# EAGLE design GBP USB-C Charging Kit (EAGLE 6.2)
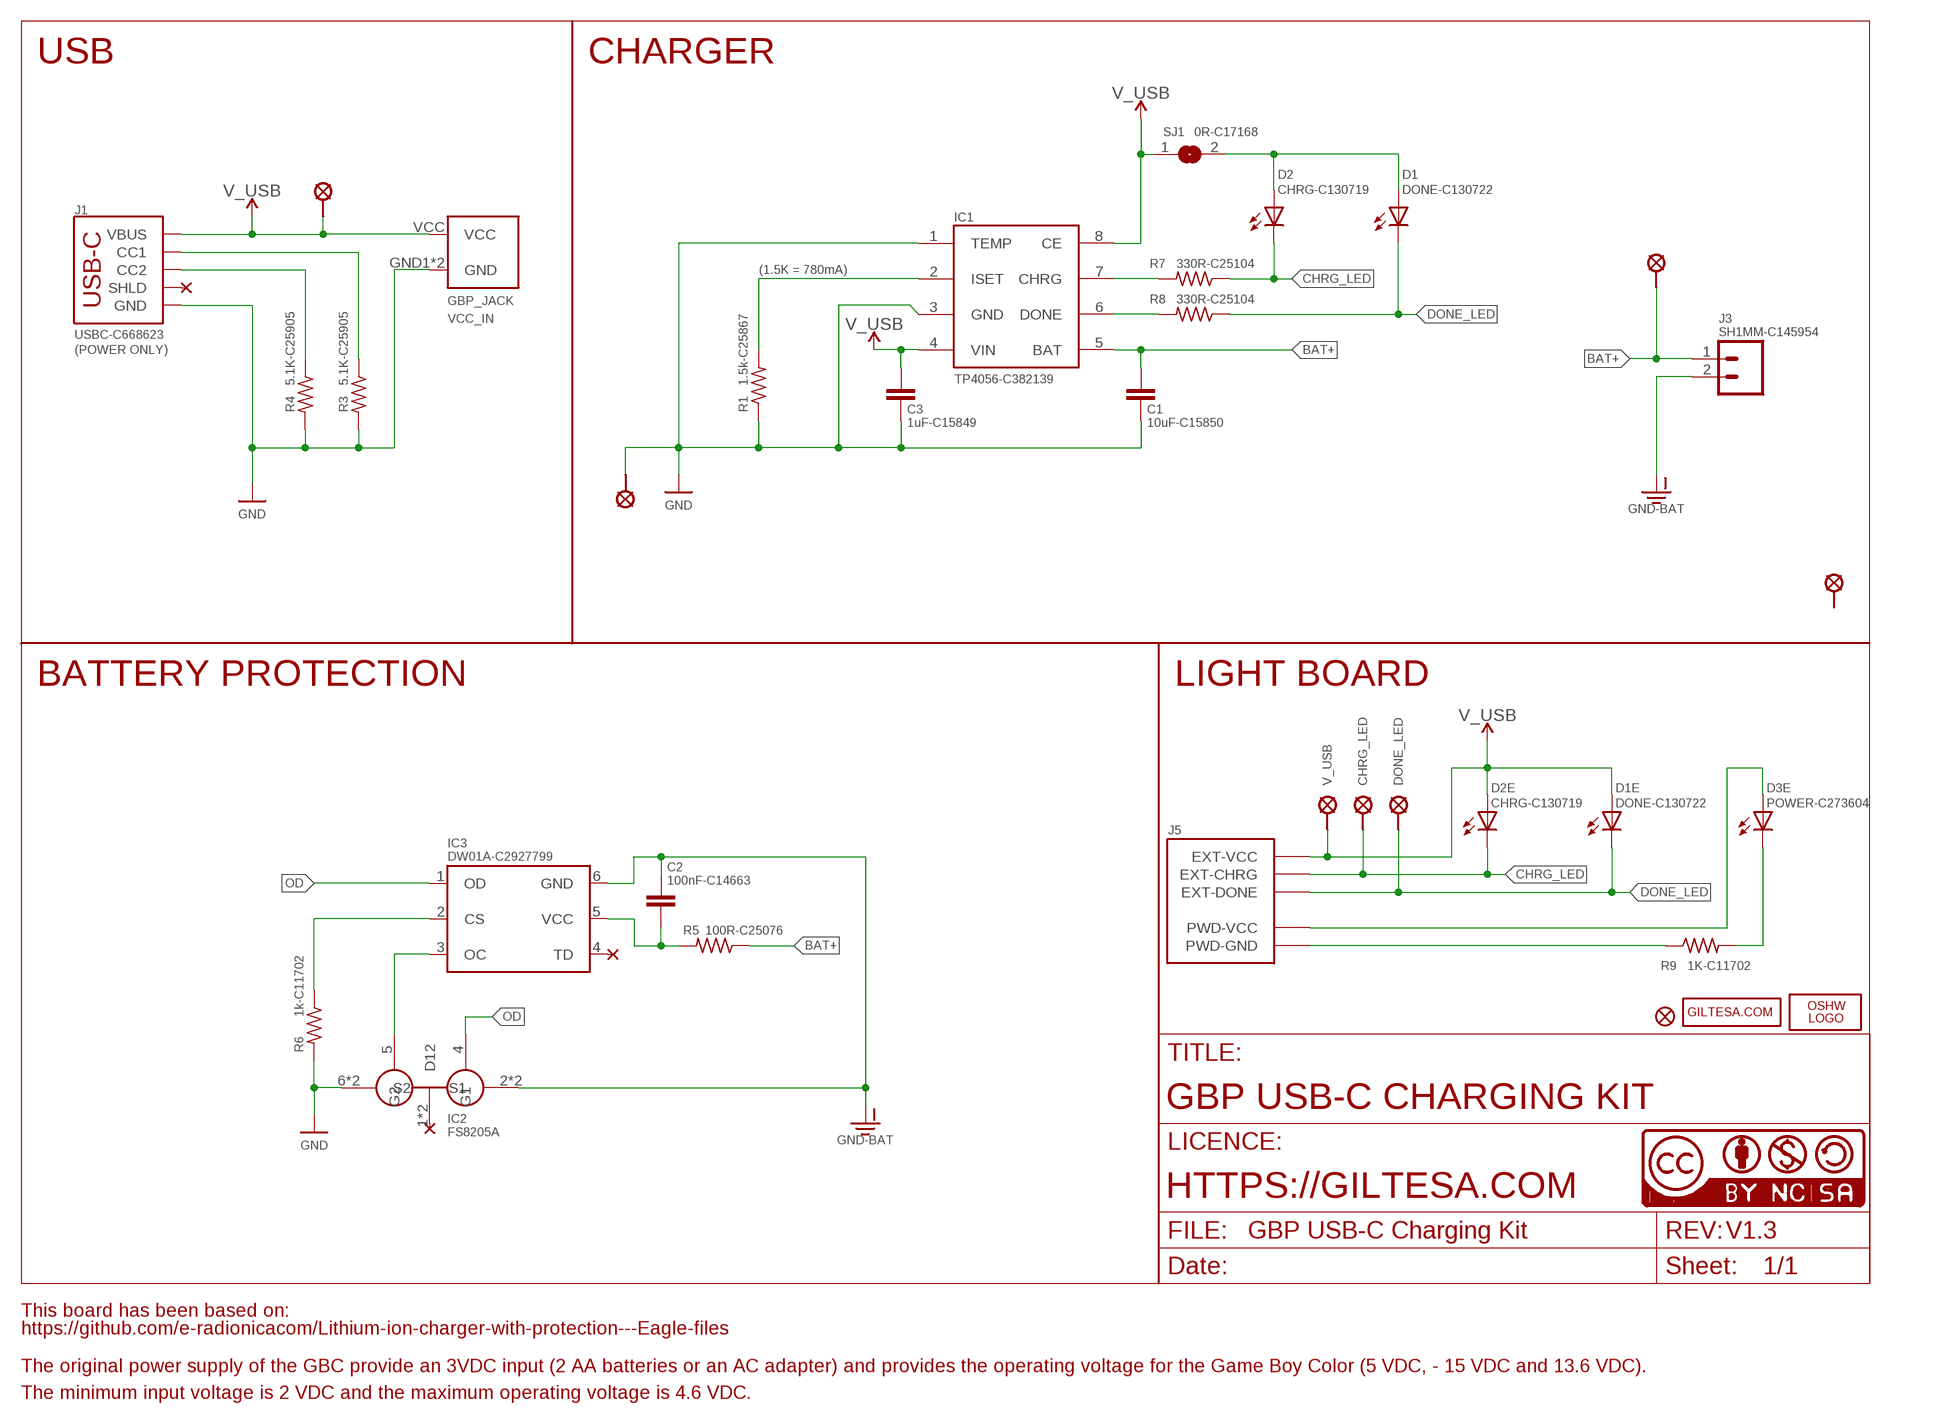
[diagram p0: schematic, sheet 1]

## Parts
C1  10uF-C15850  C0805_SMALL  [C0805_S]
C2  100nF-C14663  C0603_SMALL  [C0603_S]
C3  1uF-C15849  C0603_SMALL  [C0603_S]
D1  DONE-C130722  L0402  [L0402]
D1E  DONE-C130722  L0402  [L0402]
D2  CHRG-C130719  L0402  [L0402]
D2E  CHRG-C130719  L0402  [L0402]
D3E  POWER-C273604  L0402  [L0402]
FD1  FIDUCIALUFIDUCIAL  [FIDUCIAL-MICRO]
FD2  FIDUCIALUFIDUCIAL  [FIDUCIAL-MICRO]
FD3  FIDUCIALUFIDUCIAL  [FIDUCIAL-MICRO]
GBP_JACK  VCC_IN  GBP_POWER_JACK_DIP  [GBP_POWER_JACK_DIP]
IC1  TP4056-C382139  DIO5158  [SOIC-8]
IC2  8205A-C2929075  FS8205A  [TSSOP8]
IC3  DW01A-C2927799  DW01-P  [SOT23-6L]
J1  USBC-C668623  USB-CPOWER  [USB-C_6P]
J3  SH1MM-C145954  JST-21MM  [JST-2-1MM-SMD_RIGHT]
J5  GBP_LED  [GBP_LED]
LOGO2  OSHW_LOGO_FILLX0150-NT  [OSHW_FILLX150_NOTEXT]
R1  1.5k-C25867  R0402  [R0402]
R3  5.1K-C25905  R0402  [R0402]
R4  5.1K-C25905  R0402  [R0402]
R5  100R-C25076  R0402  [R0402]
R6  1k-C11702  R0402  [R0402]
R7  330R-C25104  R0402  [R0402]
R8  330R-C25104  R0402  [R0402]
R9  1K-C11702  R0402  [R0402]
SJ1  0R-C17168  JUMPER-SMD0402  [JUMPER-SMD_0402]
U$2  PAD_2.0  [PAD_2.0]
U$3  PAD_1.25  [PAD_1.25]
U$6  CC-BY-NC-SA15MM  [CC-BY-NC-SA_15MM]
U$12  SOLDER_PAD-2.0  [SOLDER_PAD_2.0]
U$16  GILTESA.COM_MASK  [GILTESA.COM_MASK]
U$24  CHRG_LED  SOLDER_PAD-1.3  [SOLDER_PAD_1.3]
U$25  DONE_LED  SOLDER_PAD-1.3  [SOLDER_PAD_1.3]
U$26  V_USB  SOLDER_PAD-1.3  [SOLDER_PAD_1.3]
U$41  PAD_1.25  [PAD_1.25]

## Nets
BAT+: C1.1 IC1.5(BAT) J3.1 R5.1 U$3.P$1
CHRG: IC1.7(CHRG) R7.2
CHRG_LED: D2.C D2E.C J5.EXT-CHRG R7.1 U$24.P$1
DONE: IC1.6(DONE) R8.2
DONE_LED: D1.C D1E.C J5.EXT-DONE R8.1 U$25.P$1
GND: C1.2 C3.2 GBP_JACK.GND1(GND) GBP_JACK.GND2(GND) IC1.1(TEMP) IC1.3(GND) IC2.6(S2) IC2.7(S2) J1.GND1(GND) J1.GND2(GND) R1.1 R3.2 R4.2 R6.2 U$2.P$1
GND-BAT: C2.1 IC2.2(S1) IC2.3(S1) IC3.6(GND) J3.2
ISET: IC1.2(ISET) R1.2
N$1: IC3.2(CS) R6.1
N$2: IC2.5(G2) IC3.3(OC)
N$4: J1.B5(CC2) R4.1
N$5: D1.A D2.A SJ1.2
N$11: D3E.C R9.2
N$13: J1.A5(CC1) R3.1
OD: IC2.4(G1) IC3.1(OD)
PWD-GND: J5.PWD-GND J5.PWD-GND'(PWD-GND) R9.1
PWD-VCC: D3E.A J5.PWD-VCC J5.PWD-VCC'(PWD-VCC)
V_USB: C3.1 D1E.A D2E.A GBP_JACK.VCC IC1.4(VIN) IC1.8(CE) J1.VBUS1(VBUS) J1.VBUS2(VBUS) J5.EXT-VCC SJ1.1 U$26.P$1 U$41.P$1
VCC-DW: C2.2 IC3.5(VCC) R5.2
Unconnected: IC2.1(D12) IC2.8(D12) IC3.4(TD) J1.SHLD1(SHLD) J1.SHLD2(SHLD) J1.SHLD3(SHLD) J1.SHLD4(SHLD) J1.SHLD5(SHLD) J1.SHLD6(SHLD) J1.SHLD7(SHLD) J1.SHLD8(SHLD) U$12.P$1

## Notes on the sheet
- USB | CHARGER
- (1.5K = 780mA)
- (POWER ONLY)
- BATTERY PROTECTION | LIGHT BOARD
- GBP USB-C CHARGING KIT
- IC2
- FS8205A
- HTTPS://GILTESA.COM
- V1.3
- This board has been based on:
- https://github.com/e-radionicacom/Lithium-ion-charger-with-protection---Eagle-files
- The original power supply of the GBC provide an 3VDC input (2 AA batteries or an AC adapter) and provides the operating voltage for the Game Boy Color (5 VDC, - 15 VDC and 13.6 VDC).
- The minimum input voltage is 2 VDC and the maximum operating voltage is 4.6 VDC.

## Library data of the parts
C1 = ,giltesa:C0805
C2 C3 = ,giltesa:C0603
D1 D1E D2 D2E D3E = ,giltesa:L0402
FD1-FD3 = SparkFun-Aesthetics:FIDUCIAL: Fiducial Alignment Points Point-of-reference for pick-and-place machines and other optical instruments.
GBP_JACK = ,giltesa:GBP_POWER_JACK
IC1 = ERADIONICA:DIO5158
IC2 = SparkFun:FS8205A
IC3 = lipo:DW01-P: One Cell Lithium-ion/Polymer Battery Protection IC The DW01-P battery protection IC is designed to protect lithium-ion/polymer battery from damage or degrading the lifetime due to overcharge, overdischarge, and/or overcurrent for one-cell lithium-ion/polymer battery powered systems, such as cellular phones. The ultra-small package and less required external components make it ideal to integrate the DW01-P into the limited space of battery pack. The accurate ±50mV overcharging detection voltage ensures safe and full utilization charging. The very low standby current drains little current from the cell while in storage.
J1 = ,giltesa:USB-C
J3 = ,giltesa:JST-2
J5 = ,giltesa:GBP_LED
LOGO2 = ohw-logo:OSHW_LOGO_FILL
R1 R3-R9 = ,giltesa:R0402
SJ1 = ,giltesa:JUMPER-SMD
U$2 U$3 U$41 = ,giltesa:PAD
U$6 = ,giltesa_logos:CC-BY-NC-SA
U$12 U$24-U$26 = ,giltesa:SOLDER_PAD
U$16 = ,giltesa_logos:GILTESA.COM

## Net classes
1 power: width 0.61 mm, drill 0.406 mm, clearance 0.203 mm
2 gnd: width 0.305 mm, drill 0.406 mm, clearance 0.203 mm
3 power usb: width 0.508 mm, drill 0.406 mm, clearance 0.203 mm

## Board
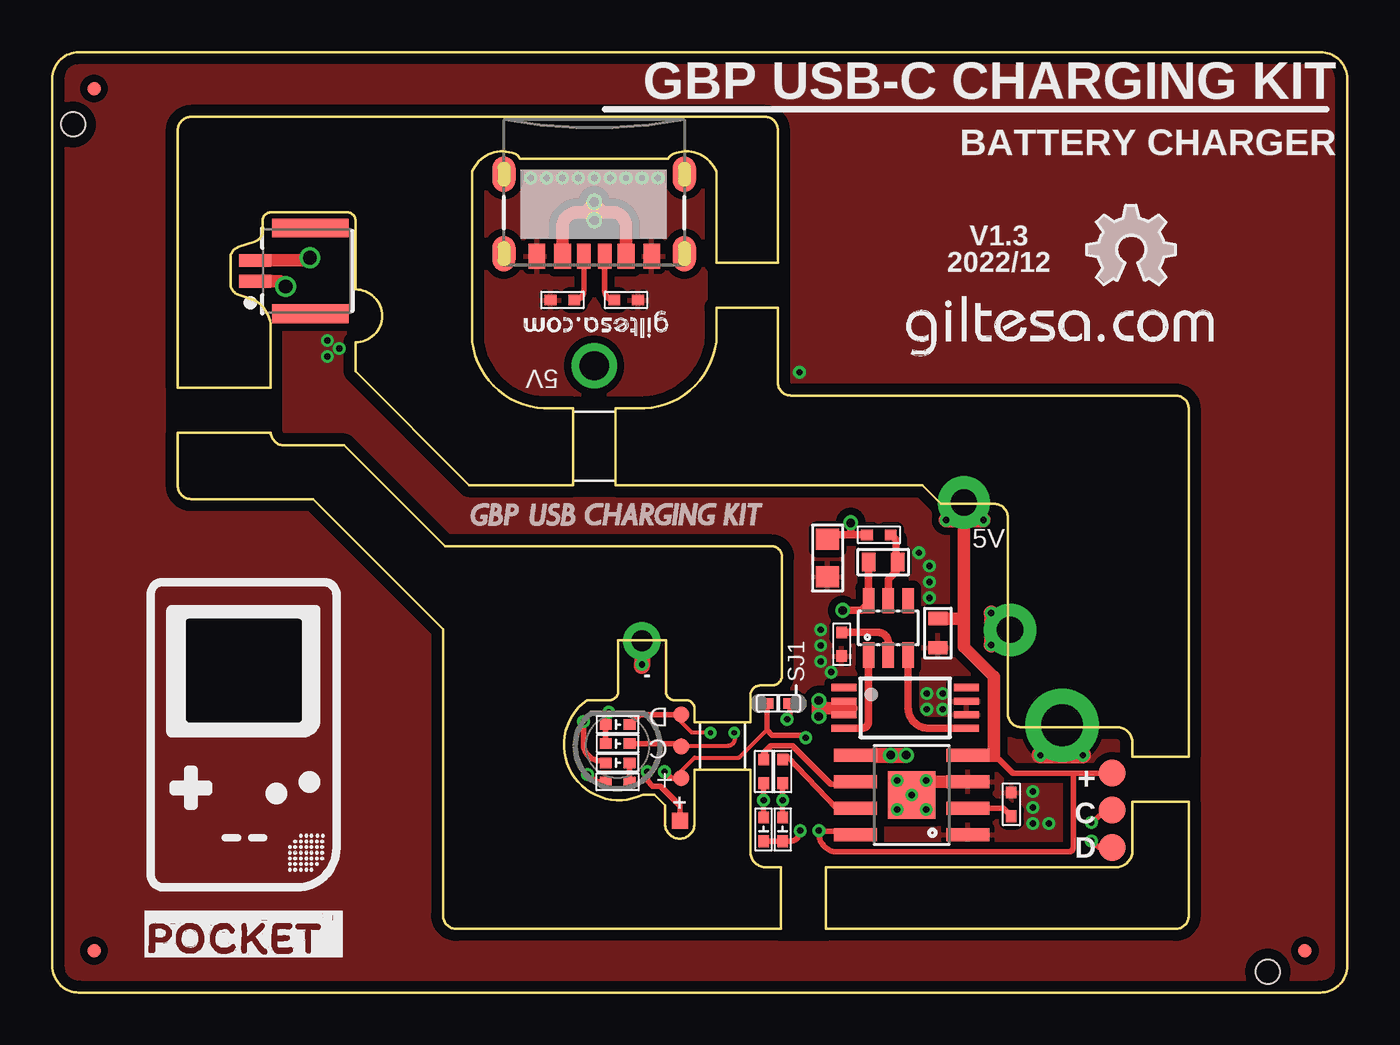
[diagram p1: board, top side]
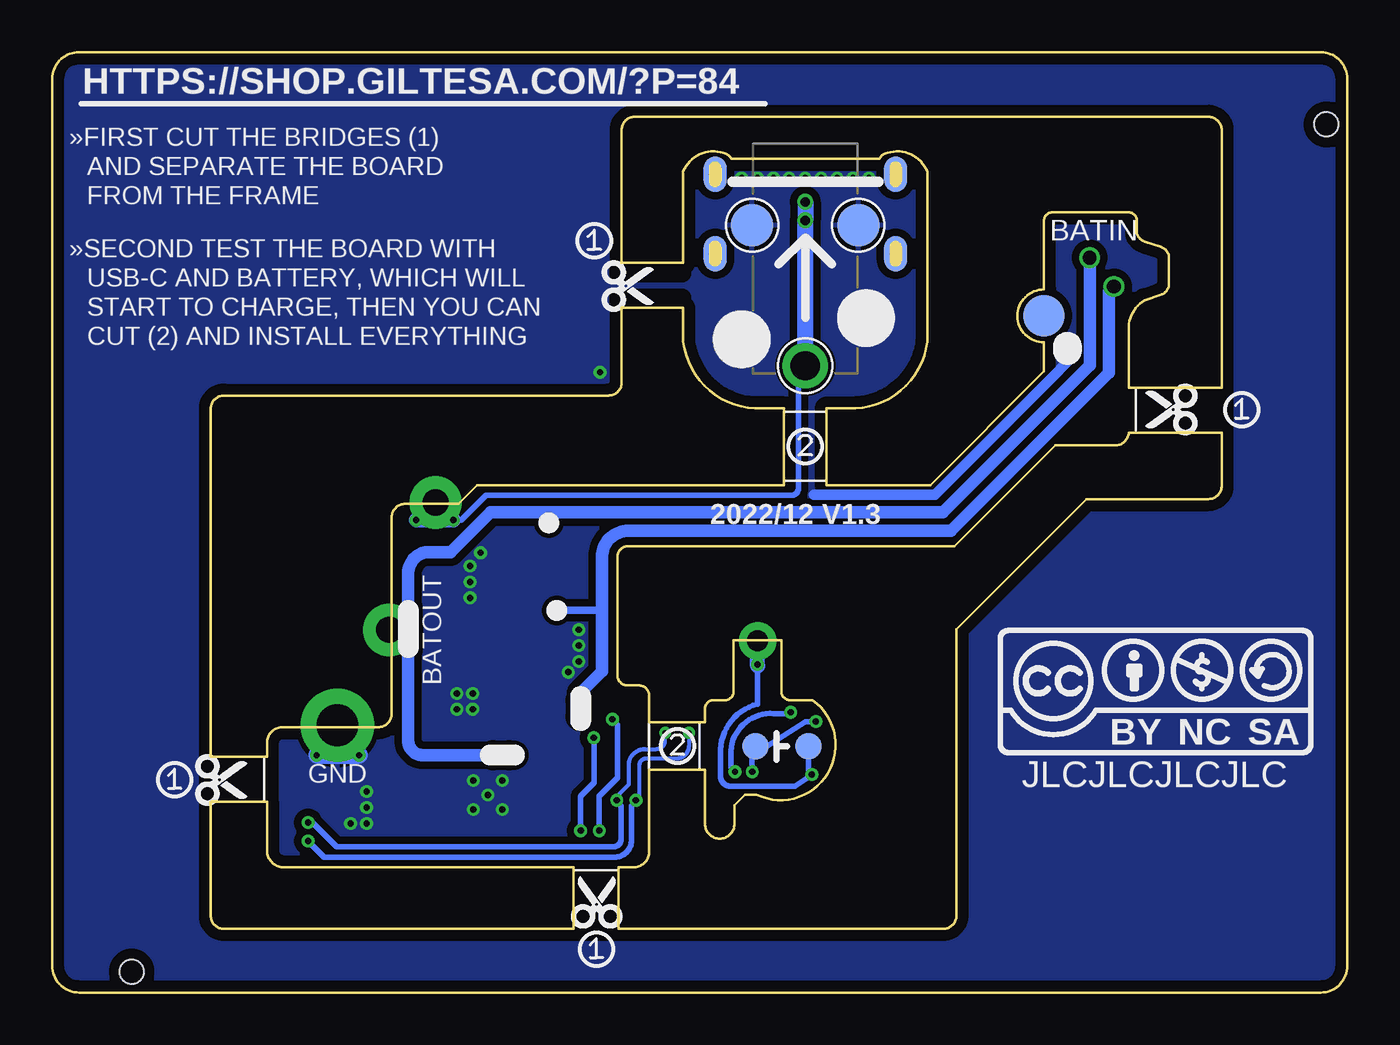
[diagram p2: board, bottom side, seen from below]

Size 62 x 45 mm. Coordinates in mm from the lower left corner, seen from the top.
Outline: 13.99,26.18 11.19,26.18 arc-90 10.46,26.79 6.01,26.79 6.01,24.25 arc90 6.64,23.62 12.49,23.62 18.71,17.39 18.71,3.68 arc90 19.35,3.04 34.89,3.04 34.89,5.99 34.18,5.99 arc-90 33.42,6.75 33.42,10.66 30.75,10.66 30.75,8.07 arc-180 29.34,8.07 29.34,8.96 28.83,9.46 28.27,9.46 arc-170 25.6,13.99 26.71,13.99 arc90 27.09,14.44 27.09,16.86 29.38,16.86 29.38,14.44 arc90 29.76,13.99 30.37,13.99 arc-90 30.75,13.55 30.75,12.94 33.42,12.94 33.42,14.19 arc-90 33.92,14.7 34.43,14.7 arc90 34.94,15.16 34.94,20.85 arc90 34.43,21.36 18.81,21.36 13.99,26.18
Outline: 19.95,24.28 14.52,29.74 14.52,31.11 arc180 14.52,33.65 14.52,36.95 arc90 14.14,37.33 10.46,37.33 arc90 10.07,36.95 10.07,36.32 arc-50 9.69,35.94 8.93,35.68 arc60 8.55,35.3 8.55,33.78 arc60 8.93,33.4 9.69,33.14 arc-50 10.46,32 10.46,28.95 6.01,28.95 6.01,41.27 arc-90 6.64,41.91 34.13,41.91 arc-90 34.74,41.27 34.74,34.92 31.79,34.92 31.79,39.3 arc90 29.74,40.14 arc40 29.49,39.9 22.4,39.9 arc40 22.16,40.14 arc90 20.11,39.3 20.11,31.14 arc80 23.54,27.96 24.93,27.96 24.93,24.28 19.95,24.28
Outline: 51.72,9.12 51.72,6.88 arc-90 50.96,5.99 37.05,5.99 37.05,3.04 53.78,3.04 arc90 54.41,3.68 54.41,9.12 51.72,9.12
Outline: 26.96,24.28 41.66,24.28 42.55,23.38 45.09,23.38 arc-90 45.75,22.75 45.75,13.34 arc90 46.38,12.7 50.96,12.7 arc-90 51.72,11.94 51.72,11.28 54.41,11.28 54.41,27.94 arc90 53.78,28.57 35.37,28.57 arc-90 34.74,29.21 34.74,32.76 31.79,32.76 31.79,31.14 arc-80 28.36,27.96 26.96,27.96 26.96,24.28
Outline: 1.27,0 60.7,0 arc90 62,1.27 62,43.73 arc90 60.7,45 1.27,45 arc90 0,43.73 0,1.27 arc90 1.27,0
Copper layers (1*16): Top 0.035mm / dielectric 1.6mm / Bottom 0.035mm
Design rules: minimum track width 6mil, minimum drill 12mil, track to track 6mil, track to pad 6mil, pad to pad 6mil, via to via 8mil, smd to smd 0mil, copper to edge 20mil, drill to drill 10mil, minimum pad ring 6mil, minimum via ring 6mil, stop-mask expansion 0mil, vias tented up to drill 100mil, thermal gap 10mil
tRestrict: area 6.6,13.1 to 11.7,17.7; 11 lines
bRestrict: 13 lines

### Footprints (pad centres in the part's own frame; a part is rotated, then mirrored left to right if it is on the bottom)
C0805_S = smd 1 x 1.1: 1 -0.901,0; 2 0.901,0
C0603_S = smd 0.635 x 0.9: 1 -0.694,0; 2 0.694,0
L0402 = smd 0.559 x 0.5: A -0.567,0; C 0.567,0
FIDUCIAL-MICRO = smd 0.635 x 0.635: 1 0,0
GBP_POWER_JACK_DIP = smd 2.032 x 2.032 bottom: GND1 -2.54,1.905; GND2 2.54,1.905 | drill 1.397 pad 2.159: VCC 0,8.636
SOIC-8 = smd 0.61 x 2.057: 1 -2.07,-2.892; 2 -0.8,-2.892; 3 0.47,-2.892; 4 1.74,-2.892; 5 1.74,2.492; 6 0.47,2.492; 7 -0.8,2.492; 8 -2.07,2.492 | smd 2.286 x 2.286: EPAD -0.165,-0.2
TSSOP8 = smd 1.2 x 0.35: 1 -2.925,0.975; 2 -2.925,0.325; 3 -2.925,-0.325; 4 -2.925,-0.975; 5 2.925,-0.975; 6 2.925,-0.325; 7 2.925,0.325; 8 2.925,0.975
SOT23-6L = smd 0.55 x 1.2: 1 -0.95,-1.3; 2 0,-1.3; 3 0.95,-1.3; 4 0.95,1.3; 5 0,1.3; 6 -0.95,1.3
USB-C_6P = smd 0.635 x 1.2: A5 -0.5,-0.017; B5 0.5,-0.017 | smd 0.8 x 1.2: GND1 -2.75,-0.017; GND2 2.75,-0.017; VBUS1 -1.52,-0.017; VBUS2 1.52,-0.017 | smd 1.1 x 1.7: SHLD1 -4.32,-0.15; SHLD2 4.32,-0.15; SHLD5 -4.32,-3.95; SHLD8 4.32,-3.95 | smd 1.1 x 1.7 bottom: SHLD3 -4.32,-0.15; SHLD4 4.32,-0.15; SHLD6 -4.32,-3.95; SHLD7 4.32,-3.95
JST-2-1MM-SMD_RIGHT = smd 0.6 x 1.524: 1 -0.5,-2.017; 2 0.5,-2.017 | smd 0.889 x 3.683: NC1 -2.054,0.635; NC2 2.054,0.635
GBP_LED = smd 0.762 x 0.762: EXT-CHRG -3.048,0; EXT-DONE -3.048,-1.524; EXT-VCC -3.048,1.524; PWD-VCC' -2.985,3.556 | smd 1.27 x 1.27 bottom: PWD-GND 1.27,0; PWD-VCC -1.27,0 | drill 1 pad 1.8: PWD-GND' -1.166,-5.048
R0402 = smd 0.559 x 0.5: 1 -0.567,0; 2 0.567,0
JUMPER-SMD_0402 = smd 0.635 x 0.5: 1 -0.559,0; 2 0.559,0
PAD_2.0 = drill 2 pad 3.5: P$1 0,0
PAD_1.25 = drill 1.25 pad 2.5: P$1 0,0
SOLDER_PAD_2.0 = smd 2 x 2: P$1 0,0
SOLDER_PAD_1.3 = smd 1.3 x 1.3: P$1 0,0
JLCPCB_TOOLING_HOLES = hole 1.153: 0,0

### Placement (x,y rotation side)
C1  37.12,20.79 270 top
C2  39.78,20.6 0 top
C3  42.4,17.2 270 top
D1  34.06,7.8 90 top
D1E  27.07,12.82 0 top
D2  34.97,7.8 90 top
D2E  27.07,11.91 0 top
D3E  27.07,10.99 0 top
FD1  2,43.26 0 top
FD2  2,2 0 top
FD3  59.97,2 0 top
GBP_JACK  25.95,38.63 180 top
IC1  40.95,9.62 90 top
IC2  40.83,13.62 0 top
IC3  40.03,17.45 0 top
J1  25.95,35.22 180 top
J3  11.73,34.54 270 top
J5  27.07,11.78 180 top
LOGO2  49.53,33.87 0 top
R1  45.92,9.01 270 top
R3  27.47,33.14 0 top
R4  24.43,33.14 180 top
R5  39.58,21.9 0 top
R6  37.79,16.67 270 top
R7  34.97,10.58 90 top
R8  34.06,10.58 90 top
R9  27.07,10.08 0 top
SJ1  34.77,13.83 0 top
U$1  [SCISSOR_ONE]  35.94,2.08 0 bottom
U$2  48.35,12.79 0 top
U$3  45.86,17.35 0 top
U$4  [GAME_BOY_POCKET_USB_CHARGING_KIT_NON]  19.94,22.35 0 top
U$6  16.74,11.36 0 bottom
U$7  [GAME_BOY_POCKET]  4.42,1.68 0 top
U$8  [SCISSOR_ONE]  36.05,35.98 0 bottom
U$9  [SCISSOR_ONE]  56.14,10.18 0 bottom
U$10  [SCISSOR_ONE]  5.05,27.9 0 bottom
U$12  14.53,32.38 0 bottom
U$13  [SCISSOR_TWO]  25.95,26.13 0 bottom
U$14  [SCISSOR_TWO]  32.07,11.8 0 bottom
U$16  40.77,30.38 0 top
U$17  [SCISSOR]  33.2,33.82 180 bottom
U$21  [SCISSOR]  35.94,5.56 270 bottom
U$24  50.74,8.73 0 top
U$25  50.74,6.95 0 top
U$26  50.74,10.51 0 top
U$28  [GAME_BOY_POCKET_2]  4.52,4.83 0 top
U$33  [GILTESA.COM_MASK_7MM]  29.52,32.68 180 top
U$37  CC-NC-BCNIX  [CC-NC-B_NIX]  0,0 0 top
U$38  CC-NC-BCNIX  [CC-NC-B_NIX]  0,0 0 top
U$39  [JLCPCB_TOOLING_HOLES]  1,41.55 0 top
U$40  [JLCPCB_TOOLING_HOLES]  58.19,1 0 top
U$41  43.64,23.45 0 top
U$43  [SCISSOR]  52.66,10.18 180 bottom
U$44  [SCISSOR]  9.67,27.9 0 bottom

### Tracks (layer width: path | path; a pad name or v marks a point on that pad's centre or on a via)
BAT+  (via drill 0.3, 0.41, 0.66)
  Top 0.356: R5.1 38.23,21.9 | 38.23,21.9 37.32,21.9 C1.1 | v38.23,22.48 38.23,21.9
  Top 0.61: J3.1 12.2,35.04 v12.33,35.17 | IC1.5 39.42,11.36
  Top 0.711: 39.42,11.36 v40.89,11.36 | v44.96,18.16 v44.96,16.64
  Bottom 0.356: v38.23,22.48 38.23,22.99
  Bottom 0.61: v12.33,35.17 12.33,30.02 19.37,22.99 38.23,22.99 41.02,22.99 42.93,21.08 43.94,21.08 arc-90 44.96,20.07 44.96,18.41 | 44.96,16.38 44.96,12.06 arc-90 44.25,11.36 v40.89,11.36
  Bottom 0.711: v40.89,11.36 v40.13,11.36 39.88,11.36 | 44.96,16.38 v44.96,16.64 | v44.96,16.64 44.96,18.41 | v44.96,16.64 44.96,17.35 U$3.P$1
CHRG
  Top 0.254: IC1.7 37.54,8.82 35.21,11.28 35.08,11.15 R7.2
CHRG_LED  (via drill 0.25, 0.3)
  Top 0.203: J5.EXT-CHRG 30.12,11.8 32.33,11.8 arc90 32.68,12.16 32.68,12.41 v32.66,12.44
  Top 0.254: D2E.C 29.99,11.91 J5.EXT-CHRG | U$24.P$1 50.59,8.86 v49.75,8.14 | D2.C v34.97,9.2 R7.1
  Bottom 0.203: v34.97,9.2 v34.97,9.21 34.97,9.39 34.4,9.96 34.4,10.89 arc90 33.63,11.65 33.06,11.65 arc-90 32.68,12.03 32.68,12.41 v32.66,12.44
  Bottom 0.254: v34.97,9.2 34.78,8.95 34.78,7.36 arc90 35.09,6.98 48.38,6.98 49.54,8.14 v49.75,8.14
DONE
  Top 0.254: R8.2 34.06,11.45 34.42,11.81 35.43,11.81 37.28,9.96 38.33,9.96 IC1.6
DONE_LED  (via drill 0.25, 0.3)
  Top 0.203: v31.51,12.44 30.62,12.44 30.11,12.94 J5.EXT-DONE
  Top 0.254: J5.EXT-DONE 28.12,13.3 D1E.C | U$25.P$1 50.11,6.95 v49.75,7.25 | D1.C v34.06,9.2 R8.1
  Bottom 0.203: v34.06,9.2 33.89,9.41 33.89,10.89 arc90 33.57,11.2 32.11,11.2 arc-90 31.51,11.8 v31.51,12.44
  Bottom 0.254: v34.06,9.2 34.27,8.93 34.27,7.3 arc90 35.09,6.47 48.97,6.47 v49.75,7.25
GND  (via drill 0.3)
  Top 0.61: IC1.3 41.78,10.09 v41.15,9.45
  Top 0.813: v49.34,11.36 v47.31,11.36
  Bottom 0.508: 25.53,23.81 19.75,23.81 13.97,29.59 v13.17,30.45
  Bottom 0.61: GBP_JACK.GND1 28.49,36.85
  Bottom 0.813: v47.31,11.36 v49.34,11.36 48.35,11.36 U$2.P$1
  other vias: 25.95,38.98 25.19,38.98 24.43,38.98 23.66,38.98 22.9,38.98 26.71,38.98 27.47,38.98 28.24,38.98 29,38.98 35.77,29.68 13.74,30.83 13.17,31.21 42.63,13.55 41.87,14.32 41.87,13.55 42.63,14.32 46.95,9.62 46.95,8.86 46.95,8.09 47.71,8.09 40.45,10.15 41.85,10.15 41.85,8.75 40.45,8.75 36.79,17.36 36.79,16.6 36.79,15.84 37.3,15.33 42,18.89 42,19.65 42,20.41 41.49,21.05
  pour Top (isolate 0.356): -2,47 63.97,47 63.97,-2 -2,-2
  pour Bottom (isolate 0.356): -2,47 63.97,47 63.97,-2 -2,-2
GND-BAT  (via drill 0.41, 0.66)
  Top 0.305: 38.25,13.61 37.93,13.29 IC2.3 IC2.2 | 37.08,13.61 37.06,13.61 arc-90 v36.7,13.97
  Top 0.356: C2.1 arc-90 C2.1 | C2.1 IC3.6 39.08,18.63 38.73,18.29 v37.85,18.29
  Top 0.61: J3.2 10.92,34.04 v11.17,33.79 | 38.25,13.61 37.08,13.61
  Top 0.711: v36.7,13.97 v36.7,13.21
  Bottom 0.356: v37.85,18.29 35.69,18.29
  Bottom 0.61: v11.17,33.79 11.43,33.53 11.43,29.66 18.99,22.1 34.42,22.1 arc-90 35.69,20.83 35.69,18.29 35.69,15.37 36.7,14.35 v36.7,13.21
  Bottom 0.711: v36.7,13.21 v36.7,13.97
ISET
  Top 0.254: IC1.2 45.54,8.82 R1.2
N$1
  Top 0.356: R6.1 39.53,17.23 arc-90 40.03,16.74 IC3.2
N$2
  Top 0.356: IC2.5 41.97,12.64 arc-90 40.98,13.63 IC3.3
N$4
  Top 0.254: J1.B5 25.45,33.6 arc-90 R4.1
N$5  (via drill 0.3)
  Top 0.254: D1.A D2.A 35.3,7.24 arc90 v35.81,7.75 | SJ1.2 35.33,13.23 v35.18,13.08
  Bottom 0.254: v35.81,7.75 35.81,9.4 34.92,10.29 34.92,12.83 v35.18,13.08
N$11
  Top 0.254: D3E.C R9.2
N$13
  Top 0.254: J1.A5 26.45,33.6 arc90 R3.1
OD
  Top 0.356: IC3.1 39.08,12.91 arc-90 38.68,12.64 IC2.4
PWD-GND  (via drill 0.3)
  Top 0.254: R9.1 26.11,10.08 v25.63,10.43
  Top 0.762: J5.PWD-GND' 28.23,15.62 v28.23,15.7
  Bottom 0.254: J5.PWD-GND 25.8,10.6 v25.63,10.43 26.45,9.87 29.5,9.87 arc90 30.01,10.38 30.01,11.39 arc78 28.23,13.81 28.23,15.62 v28.23,15.7
  Bottom 0.711: 28.23,15.62 J5.PWD-GND'
PWD-VCC  (via drill 0.3)
  Top 0.254: D3E.A 26.26,11.1 arc-90 25.44,11.84 v25.44,12.97 25.44,12.78 | J5.PWD-VCC' 30.05,8.94 29.12,9.87 28.74,9.87 28.49,10.12 v28.49,10.57
  Bottom 0.254: v25.44,12.97 25.95,12.97 27.77,11.78 J5.PWD-VCC 28.49,11.63 v28.49,10.57
V_USB  (via drill 0.3, 0.46)
  Top 0.203: J5.EXT-VCC 30.11,10.61 30.75,11.24 32.88,11.24 34.21,12.57
  Top 0.254: D2E.A D1E.A 26.5,13.27 v26.65,13.41 | J5.EXT-VCC 29.61,10.26 v29.31,10.57 | 50.26,10.49 50.59,10.49 U$26.P$1 48.9,10.51 | SJ1.1 34.21,12.57 34.46,12.32 35.94,12.32 v36.07,12.19 | IC1.4 44.52,11.36 44.7,11.18 45.31,11.18 45.98,10.51 48.9,10.51 | 39.06,7.55 IC1.8 38.3,7.55 38.3,7.72 36.7,7.72 v36.7,7.75 arc98 37.59,6.73 48.64,6.73 arc90 48.9,6.99 48.9,10.51
  Top 0.61: J1.VBUS2 24.43,36.55 arc-90 25.09,37.33 25.57,37.33 v25.95,37.84 26.33,37.33 26.86,37.33 arc-90 27.47,36.6 J1.VBUS1 | v25.95,36.95 25.95,37.18 25.98,37.21 | 43.64,17.78 43.64,16.56 45.09,15.11 45.09,11.35 44.89,11.36 IC1.4 | C3.1 43.53,17.89 43.64,17.78 | 43.64,17.78 U$41.P$1
  Top 0.711: v44.58,22.61 v42.8,22.61
  Bottom 0.254: v26.65,13.41 26.71,13.35 27.47,13.35 arc-90 29.5,11.57 29.5,10.75 v29.31,10.57 | GBP_JACK.VCC 26.28,29.71 26.28,24.13 arc90 26.61,23.8 41.23,23.8 42.42,22.61 v42.8,22.61 | v36.07,12.19 36.07,10.03 36.7,9.4 v36.7,7.75
  Bottom 0.711: v44.58,22.61 v42.8,22.61 43.64,22.61 U$41.P$1
  Bottom 0.762: GBP_JACK.VCC v25.95,36.95 v25.95,37.84
VCC-DW
  Top 0.356: IC3.5 40.03,19.78 40.39,20.14 40.39,20.52 | 40.14,21.83 R5.2 40.39,21.66 40.39,20.52 | 40.39,20.52 C2.2

### Text on the board
tPlace: GBP USB-C CHARGING KIT | BATTERY CHARGER | V1.3 | 2022/12 | 5V | 5V | - | SJ1 | D | C | + | + | + | C | D
bPlace: HTTPS://SHOP.GILTESA.COM/?P=84 | »FIRST CUT THE BRIDGES (1) | AND SEPARATE THE BOARD | FROM THE FRAME | BATIN | »SECOND TEST THE BOARD WITH | USB-C AND BATTERY, WHICH WILL | START TO CHARGE, THEN YOU CAN | CUT (2) AND INSTALL EVERYTHING | 2022/12 V1.3 | BATOUT | GND | JLCJLCJLCJLC
tDocu: 41.22047